# Altium project Soldeerstation.PrjPcb
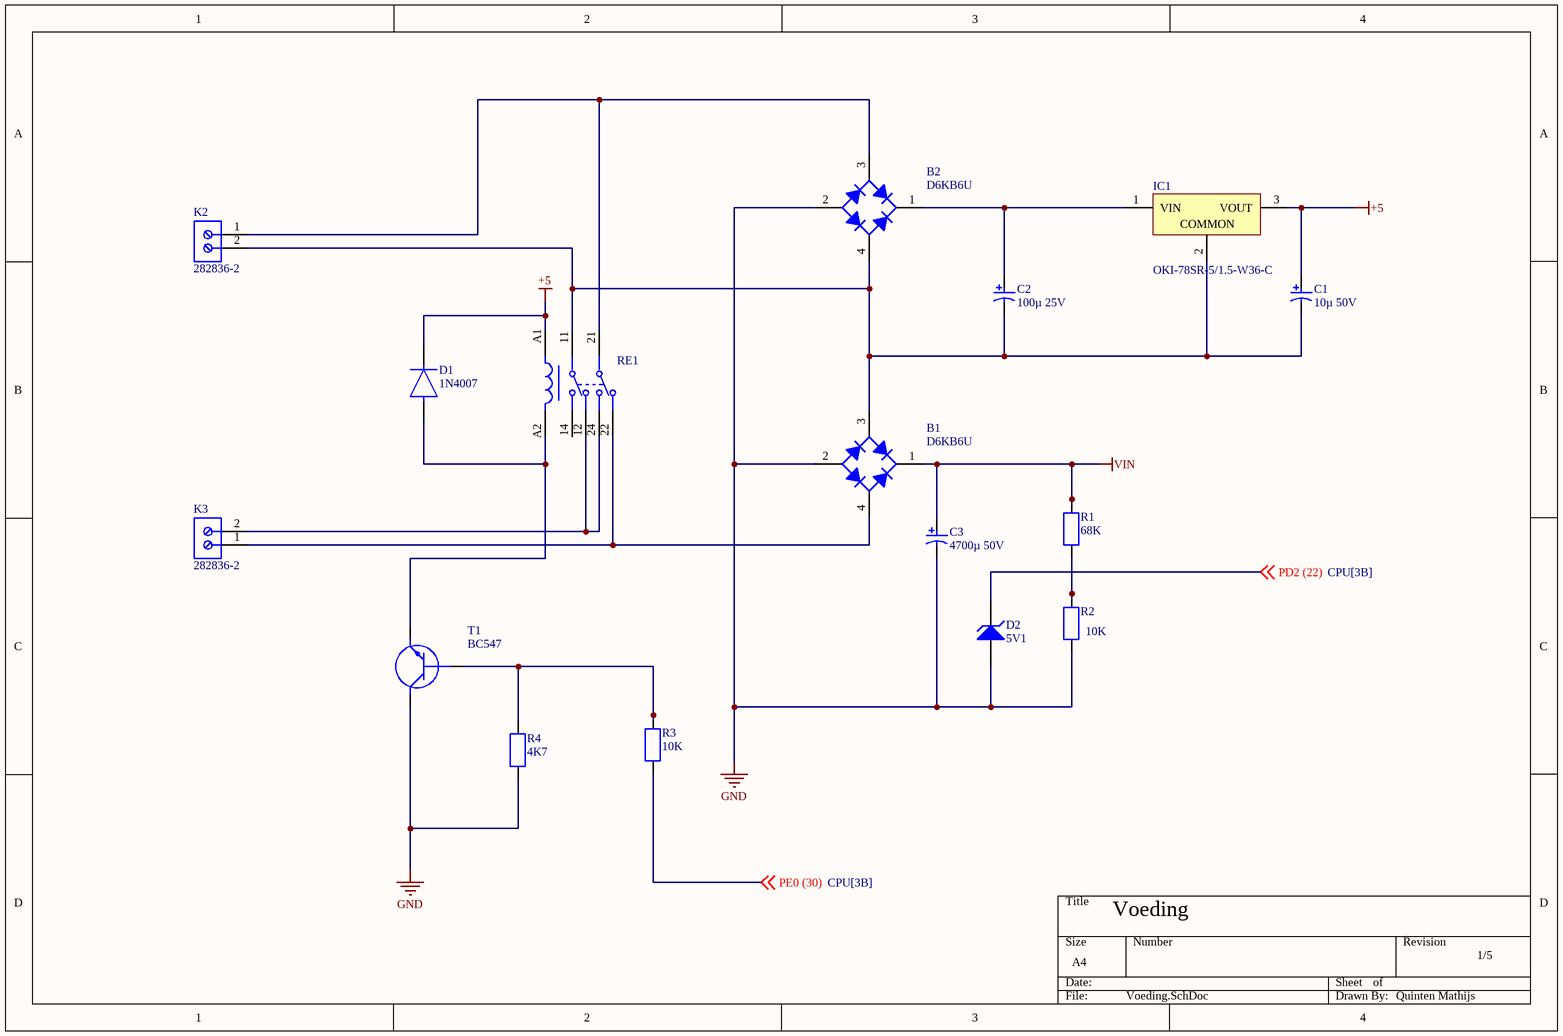
[diagram p0: Voeding.SchDoc]
5 sheets, 74 parts. Net scope: global (net labels, ports and power ports of the same name join across sheets).
Board file: PCB1.PcbDoc
Sheets:
  Voeding.SchDoc
  CPU.SchDoc
  Display.SchDoc
  PWM_soldeerbout.SchDoc
  Thermokoppel.SchDoc

## Sheet Voeding.SchDoc: Soldeerstation
size A4; Revision: 1/5; SheetNumber: 1; SheetTotal: 5

### Parts
B1  D6KB6U  [ttf]
B2  D6KB6U  [ttf]
C1  10µ 50V  [CE_D8_L10]
C2  100µ 25V  [CE_D8_L10]
C3  4700µ 50V  [CE_D25_L25_plugin]
D1  1N4007  [SOD-123FL]
D2  5V1  [SOD-123FL]
IC1  OKI-78SR-5/1.5-W36-C  [OKI78SR515W36C]
K2  282836-2  [TECO-282836-2_V]
K3  282836-2  [TECO-282836-2_V]
R1  68K  [R_0805_L]
R2  10K  [R_0805_L]
R3  10K  [R_0805_L]
R4  4K7  [R_0805_L]
RE1  (no value)  [RT42]
T1  BC547  [SOT_23]

### Nets
+5: C1.2 D1.1(C) IC1.3(VOUT) RE1.A1
GND: B1.2(A) B2.2(A) C3.1 D2.2(A) R2.1 R4.1 T1.1(C)
VIN: B1.1(K) C3.2 R1.2
PD2 (22): D2.1(K) ; off-sheet PD2 (22)
PE0 (30): R3.1 ; off-sheet PE0 (30)
NetB1_3: B1.3(C) B2.4(C) C1.1 C2.1 IC1.2(COMMON) K2.2 RE1.11
NetB1_4: B1.4(C) K3.1 RE1.22
NetB2_1: B2.1(K) C2.2 IC1.1(VIN)
NetB2_3: B2.3(C) K2.1 RE1.21
NetD1_2: D1.2(A) RE1.A2 T1.3(E)
NetK3_2: K3.2 RE1.12 RE1.24
NetR1_1: R1.1 R2.2
NetR3_2: R3.2 R4.2 T1.2(B)

Not connected (* = marked no-connect by the designer): RE1 14

### Notes on the sheet
- Voeding
- 1/5
- Quinten Mathijs

### Library data of the parts
B1 B2 = Bridge_Rectifier: Manufacturer: Diodes Inc; Average Rectified Current-Max: 0.8A; Reverse Voltage-Max [Vrrm]: 600V; Forward Voltage: 1V; Peak Current-Max: 30A; Reverse Current-Max: 5µA; Package Version: 05/2016; Package URL: http://www.diodes.com/_files/packages/MiniDIP.pdf; Datasheet Version: Rev. 13-2, 12/2010; Datasheet URL: http://www.diodes.com/_files/datasheets/ds17003.pdf; Mounting Technology: SurfaceMount; Manufacturer URL: http://www.diodes.com/; Package Reference: MiniDIP-4; Package Description: 4-Pin Small Outline Integrated Circuit, Body 4.7 x 3.8 mm, Pitch 2.5 mm
C1 C3 = Capacitor_Electrolytic: Manufacturer: Panasonic; Voltage Rating: 25 V; ComponentLink2URL: http://industrial.panasonic.com/cdbs/www-data/pdf/RDE0000/ABA0000C1181.pdf; Height: 10.2 mm; Max Operating Temperature: 105 degC; PackageReference: EEE-FK1E221P; ComponentLink1Description: Manufacturer URL; ComponentLink1URL: http://www.panasonic.com/; Mount: Surface Mount; REACH SVHC: No SVHC; Min Operating Temperature: -55 degC; ComponentLink2Description: Datasheet; DatasheetVersion: 03/2016; Length: 10.2 mm; RoHSCompliant: true; Packaging: Tape and Reel; Package Quantity: 500; Lead Pitch: 3.1 mm; Pins: 2; PackageDescription: 2-Pin Electrolytic Aluminum Capacitor, Body 8.3 x 8.3 mm; Mounting Technology: Surface Mount
C2 = Capacitor_Electrolytic: Manufacturer: Panasonic; ComponentLink2URL: http://industrial.panasonic.com/cdbs/www-data/pdf/RDE0000/ABA0000C1181.pdf; Voltage Rating: 25 V; Height: 10.2 mm; Max Operating Temperature: 105 degC; PackageReference: EEE-FK1E221P; ComponentLink1Description: Manufacturer URL; ComponentLink1URL: http://www.panasonic.com/; Mount: Surface Mount; REACH SVHC: No SVHC; Min Operating Temperature: -55 degC; ComponentLink2Description: Datasheet; DatasheetVersion: 03/2016; Length: 10.2 mm; RoHSCompliant: true; Packaging: Tape and Reel; Package Quantity: 500; Lead Pitch: 3.1 mm; Pins: 2; PackageDescription: 2-Pin Electrolytic Aluminum Capacitor, Body 8.3 x 8.3 mm; Mounting Technology: Surface Mount
D1 = Diode: Manufacturer: Diotec; Max Surge Forward Current: 27A; Forward Current: 1A; Max Junction Temp: +175°C; Reverse Voltage: 1000V; Value: 15pF; Peak Reverse Current: 5uA; Category: Diode; Temperature Range Low: -50°C; Automotive: No; Temperature: -50°C to +175°C; Lead Free: Yes; ComponentLink2Description: Datasheet; Max Repetitive Reverse Voltage: 1000V; ComponentLink2URL: https://datasheet.octopart.com/1N4007-Diotec-datasheet-62346875.pdf; Manufacturer Part Number: 1N4007; Device Class L3: Rectifier Diodes; Height: 2.8mm; Octopart: https://octopart.com/1n4007-diotec-4040411; Package: 1N4007; Temperature Range High: +175°C; Device Class L1: Discrete Semiconductors; Device Class L2: Diodes; RoHS: TRUE; Capacitance: 15pF; Ipc Land Pattern Name: DIOAD888W100L520D280
D2 = Zener_Diode: Manufacturer: On Semiconductor; PartNumber: 1SMB5920BT3G; Packing: Tape and Reel; VZ Typ (V): 6.2; PackageDescription: 2-Pin Small Molded Package, J-Bend Lead, Body 4.33 x 3.625 mm; Mounting Technology: Surface Mount; PackageVersion: Rev. H, 05/2011; ComponentLink1Description: Manufacturer URL; RoHS: Pb-Free; DatasheetVersion: Rev. 8; ComponentLink2Description: Datasheet; ComponentLink2URL: http://www.onsemi.com/pub_link/Collateral/1SMB5913BT3-D.PDF; ComponentLink1URL: http://www.onsemi.com/; ComponentLink3Description: Package Specification; PackageReference: SMB-2-403A-03_H; ComponentLink3URL: http://www.onsemi.com/pub_link/Collateral/1SMB5913BT3-D.PDF
IC1 = OKI-78SR-5/1.5-W36-C: Non-Isolated DC/DC Converter, 7.5 W, 7 to 36 V, 1.5 A, -40 to 85 degC, 3-Pin THD, RoHS; Manufacturer: Murata; Current - Output (Max): 1.5A; Power (Watts) - Max: 8W; Efficiency: 90.5%; Voltage - Input (Min): 7V; Voltage - Input (Max): 36V; Voltage - Output 1: 5V; Number of Outputs: 1; Package / Case: 3-SIPModule; Features: SCP; Type: LinearRegulatorReplacement; Size / Dimension: 0.41"Lx0.30"Wx0.65"H(10.4mmx7.6mmx16.5mm); Datasheet URL: https://datasheet.ciiva.com/8006/1790439-8006672.pdf; Datasheet Version: Oct-13; Power (Watts) - Manufacture Series: 8W; Voltage - Output 2: -; Series: Okami™OKI-78SR; Family: DCDCConverters; Manufacturer URL: http://www.murata.com/; Category: PowerSupplies-BoardMount; Voltage - Isolation: -; Packaging: Tube; Applications: ITE(Commercial); Mounting Type: ThroughHole; Voltage - Output 3: -; Operating Temperature: -40degC~85degC
K2 K3 = CMP-1684-00017-1: Female Header, Pitch 5 mm, 1 x 2 Position, Height 10 mm, Tail Length 3.5 mm, Rohs, Bulk; Manufacturer: TE Connectivity; Wire Gauge: 16-30AWG; Product Training Modules: Wire-to-BoardEurostyleTerminalBlocks; Clamp Material - Plating: Brass-NickelPlated; Voltage: 300V; Mating Orientation: HorizontalwithBoard; Current: 13.5A; Pitch: 0.197"(5.00mm); Screw Thread: M3; 3D Model: 282836-2.pdf; Other Names: 5ULV-02B / A98076; Dynamic Catalog: BuchananSeries; Number of Levels: 1; Torque - Screw: 0.68Nm(6Lb-In); Featured Product: EurostyleTerminalBlockConnectors; Positions Per Level: 2; Wire Termination: Screw-RisingCageClamp; Datasheet URL: http://www.te.com.cn/commerce/DocumentDelivery/DDEController?Action=showdoc&DocId=Catalog+Section%7F1308389_EUROSTYLE_TERMINAL_BLOCKS%7F0607%7Fpdf%7FEnglish%7FENG_CS_1308389_EUROSTYLE_TERMINAL_BLOCKS_0607.pdf%7F282836-2; Color: Green; Family: TerminalBlocks-WiretoBoard; RoHS Information: 282836-2StatementofCompliance; Standard Package: 300; Contact Material - Plating: Brass-TinPlated; Manufacturer URL: http://www.te.com; Housing Material: Polyamide(PA66),Nylon6/6; Features: Interlocking(Side); Package Description: Female Header, Pitch 5 mm, 1 x 2 Position, Height 10 mm, Tail Length 3.5 mm; Mounting Type: ThroughHole; Package Reference: THD; Packaging: Bulk; Series: Buchanan; Category: Connectors,Interconnects; Screw Material - Plating: Brass-NickelPlated
R1-R4 = 0805 (Resistor): Resistor; Manufacturer: Vishay Dale; Part Number: CRCW08050000Z0EA
RE1 = RELAY_GENERAL_PURPOSE: Manufacturer Part Number: RT424005; Manufacturer: TE Connectivity; Coil Power: 403mW; Throw Configuration: DPDT; Coil Voltage: 5V; Number Of Contacts: 2; Coil Resistance: 62Ω; Current Rating: 8A; Coil Type: Non-Latching; Category: Relay; Octopart: https://octopart.com/5-1393243-9-te+connectivity-41835766; Device Class L3: Power Relays; ComponentLink2URL: https://www.te.com/commerce/DocumentDelivery/DDEController?Action=showdoc&DocId=Data+Sheet%7FRT2%7F1014%7Fpdf%7FEnglish%7FENG_DS_RT2_1014.pdf%7F5-1393243-9; Ambient Temperature Range High: +85°C; ComponentLink2Description: Datasheet; Digikey Description: RELAY GENERAL PURPOSE DPDT 8A 5V; Package: RT424005; Automotive: No; Device Class L1: Electromechanical; Height: 15.7mm; Device Class L2: Relays; Ambient Temperature Range Low: -40°C; Mouser Description: General Purpose Relay, Rt2 Series, Power, Non Latching, Dpdt, 5 Vdc, 8 A Rohs Compliant: Yes; Lead Free: Yes; RoHS: TRUE
T1 = Transistor_NPN: Manufacturer: On Semiconductor; PartNumber: BC547C; IC Continuous (A): 0.1; fT Min (MHz): 150; Packing: Bulk Box; Polarity: NPN; Mounting Technology: Through Hole; ComponentLink1URL: http://www.onsemi.com/; ComponentLink1Description: Manufacturer URL; ComponentLink3URL: http://www.onsemi.cn/pub_link/Collateral/2N6426-D.PDF; DatasheetVersion: Rev. 7; PackageVersion: Rev. AM; RoHS: FALSE; ComponentLink2URL: http://www.onsemi.com/pub_link/Collateral/BC546-D.PDF; ComponentLink3Description: Package Specification; PackageDescription: 3-Pin Transistor Outline, Body 4.825 x 3.685 mm, Pitch 1.27 mm; PackageReference: TO-92-3-29-11_AM_SL; ComponentLink2Description: Datasheet

## Sheet CPU.SchDoc
size A4; SheetNumber: 2; SheetTotal: 5
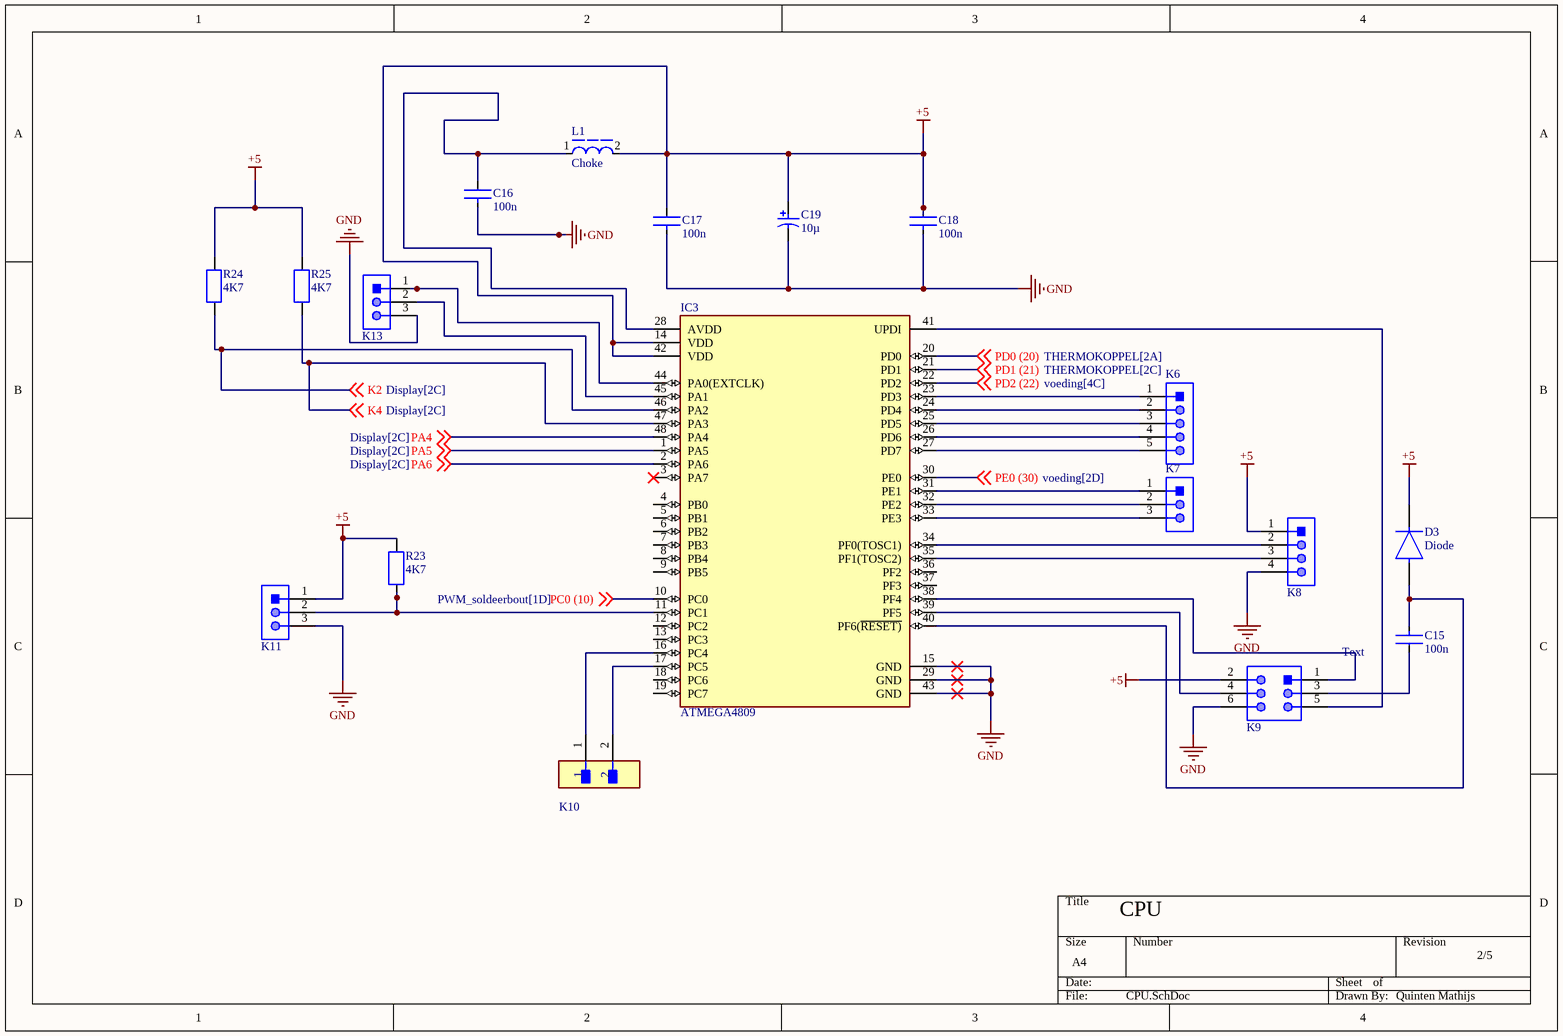
[diagram p1: CPU.SchDoc]

### Parts
C15  100n  [CC_0805_L]
C16  100n  [CC_0805_L]
C17  100n  [CC_0805_L]
C18  100n  [CC_0805_L]
C19  10µ  [CE_D8_L10]
D3  Diode  [SOD-123FL]
IC3  ATMEGA4809  [TQFP_48_M]
K6  (no value)  [pin header 1x5]
K7  (no value)  [pin header 1x3]
K8  61300411121  [pin header 1x4]  (value not drawn)
K9  61300621121  [pin header 2x6]  (value not drawn)
K10  M20-9990246  [pin header 1x2]  (value not drawn)
K11  61300311121  [pin header 1x3]  (value not drawn)
K13  61300311121  [pin header 1x3]  (value not drawn)
L1  Choke  [CC_0805_L]
R23  4K7  [R_0805_L]
R24  4K7  [R_0805_L]
R25  4K7  [R_0805_L]

### Nets
+5: C17.2 C18.2 C19.2 D3.1(C) IC3.14(VDD) IC3.42(VDD) K8.1 K9.2 K11.1 L1.2 R23.2 R24.2 R25.2
GND: C16.1 C17.1 C18.1 C19.1 IC3.15(GND) IC3.29(GND) IC3.43(GND) K8.4 K9.6 K11.3 K13.3
K2: IC3.46(PA2) R24.1 ; off-sheet K2
K4: IC3.47(PA3) R25.1 ; off-sheet K4
PA4: IC3.48(PA4) ; off-sheet PA4
PA5: IC3.1(PA5) ; off-sheet PA5
PA6: IC3.2(PA6) ; off-sheet PA6
PC0 (10): IC3.10(PC0) ; off-sheet PC0 (10)
PD0 (20): IC3.20(PD0) ; off-sheet PD0 (20)
PD1 (21): IC3.21(PD1) ; off-sheet PD1 (21)
PD2 (22): IC3.22(PD2) ; off-sheet PD2 (22)
PE0 (30): IC3.30(PE0) ; off-sheet PE0 (30)
NetC15_1: C15.1 D3.2(A) IC3.40(PF6(~{RESET)})
NetC15_2: C15.2 K9.3
NetC16_2: C16.2 IC3.28(AVDD) L1.1
NetIC3_11: IC3.11(PC1) K11.2 R23.1
NetIC3_16: IC3.16(PC4) K10.1
NetIC3_17: IC3.17(PC5) K10.2
NetIC3_23: IC3.23(PD3) K6.1
NetIC3_24: IC3.24(PD4) K6.2
NetIC3_25: IC3.25(PD5) K6.3
NetIC3_26: IC3.26(PD6) K6.4
NetIC3_27: IC3.27(PD7) K6.5
NetIC3_31: IC3.31(PE1) K7.1
NetIC3_32: IC3.32(PE2) K7.2
NetIC3_33: IC3.33(PE3) K7.3
NetIC3_34: IC3.34(PF0(TOSC1)) K8.2
NetIC3_35: IC3.35(PF1(TOSC2)) K8.3
NetIC3_38: IC3.38(PF4) K9.1
NetIC3_39: IC3.39(PF5) K9.4
NetIC3_41: IC3.41(UPDI) K9.5
NetIC3_44: IC3.44(PA0(EXTCLK)) K13.1
NetIC3_45: IC3.45(PA1) K13.2

Not connected (* = marked no-connect by the designer): IC3 3(PA7)* 4(PB0) 5(PB1) 6(PB2) 7(PB3) 8(PB4) 9(PB5) 12(PC2) 13(PC3) 18(PC6) 19(PC7) 36(PF2) 37(PF3)

### Notes on the sheet
- Text
- CPU
- 2/5
- Quinten Mathijs

### Library data of the parts
C15-C18 = Capacitor_Ceramic: Manufacturer: KEMET; Manufacturer Part Number: C0805C224K5RACTU; Value: 0.22 μF; Temperature Characteristic: X7R; Temperature Coefficient: 30ppm/°C; Tolerance: 0.1; Voltage Rating: 50 V; ComponentLink2URL: https://content.kemet.com/datasheets/KEM_C1003_C0G_SMD.pdf; Device Class L3: Ceramic Capacitors; Lead Free: Yes; Temperature: -55°C to +125°C; RoHS: TRUE; Capacitance: 0.22 μF; Automotive: No; Material: Ceramic; Octopart: https://octopart.com/c0805c224k5ractu-kemet-144670; Temperature Range Low: -55°C; Height: 0.88mm; Device Class L1: Passive Components; Digikey Description: CAP CER 0.22UF 50V X7R 0805; ComponentLink2Description: Datasheet; Mouser Description: CAP CER 0.22UF 50V X7R 0805; Category: Cap; Ipc Land Pattern Name: CAPC200125X78; Temperature Range High: +125°C; Package: C0805C-DN; Device Class L2: Capacitors
C19 = Capacitor_Electrolytic: as C1 on sheet Voeding; ComponentLink2URL: http://industrial.panasonic.com/cdbs/www-data/pdf/RDE0000/ABA0000C1181.pdf; Height: 10.2 mm; Max Operating Temperature: 105 degC; PackageReference: EEE-FK1E221P; ComponentLink1Description: Manufacturer URL; ComponentLink1URL: http://www.panasonic.com/; Mount: Surface Mount; REACH SVHC: No SVHC; Min Operating Temperature: -55 degC; ComponentLink2Description: Datasheet; DatasheetVersion: 03/2016; Length: 10.2 mm; RoHSCompliant: true; Packaging: Tape and Reel; Package Quantity: 500; Lead Pitch: 3.1 mm; Pins: 2; PackageDescription: 2-Pin Electrolytic Aluminum Capacitor, Body 8.3 x 8.3 mm; Mounting Technology: Surface Mount
D3 = Diode: Manufacturer Part Number: 1N4007; Manufacturer: Diotec; Max Surge Forward Current: 27A; Forward Current: 1A; Max Junction Temp: +175°C; Reverse Voltage: 1000V; Value: 15pF; Peak Reverse Current: 5uA; Category: Diode; Temperature Range Low: -50°C; Automotive: No; Temperature: -50°C to +175°C; Lead Free: Yes; ComponentLink2Description: Datasheet; Max Repetitive Reverse Voltage: 1000V; ComponentLink2URL: https://datasheet.octopart.com/1N4007-Diotec-datasheet-62346875.pdf; Device Class L3: Rectifier Diodes; Height: 2.8mm; Octopart: https://octopart.com/1n4007-diotec-4040411; Package: 1N4007; Temperature Range High: +175°C; Device Class L1: Discrete Semiconductors; Device Class L2: Diodes; RoHS: TRUE; Capacitance: 15pF; Ipc Land Pattern Name: DIOAD888W100L520D280
IC3 = ATMEGA4809: Peripherals: Brown-out Detect/Reset; Number of I/Os: 41; Core Architecture: AVR; Memory Size: 48KB; Interface: I2C; Oscillator Type: Internal; Memory Type: FLASH; Series: megaAVR® 0, Functional Safety (FuSa); Min Operating Temperature: -40°C; Mount: Surface Mount; Case/Package: TQFP; RoHS Compliant: Yes; Max Operating Temperature: 85°C
K6 = pin header 1x5: THT Vertical Pin Header WR-PHD, Pitch 2.54 mm, Single Row, 5 pins; Part Number: 61300511121; Manufacturer: Wurth Elektronik; Pin Number: 5; Contact Resistance: 20mOhm; Working Voltage: 250VAC; Pitch: 2.54mm; Withstanding Voltage: 500VAC; Rated Current: 3A; Gender: Male; Datasheet URL: https://katalog.we-online.de/em/datasheet/6130xx11121.pdf; Orientation: Vertical; Mounting Technology: THT; Row Number: Single; Package Reference: 61300511121; Publisher: WurthElektronik; Packaging: Bag; Manufacturer URL: http://www.we-online.de; Operating Temperature: -40to105degC
K7 = pin header 1x3pin: THT Vertical Pin Header WR-PHD, Pitch 2.54 mm, Single Row, 3 pins; Part Number: 61300311121; Manufacturer: Wurth Elektronik; Withstanding Voltage: 500VAC; Working Voltage: 250VAC; Rated Current: 3A; Pitch: 2.54mm; Pin Number: 3; Gender: Male; Contact Resistance: 20mOhm; Package Reference: 61300311121; Manufacturer URL: http://www.we-online.de; Datasheet URL: https://katalog.we-online.de/em/datasheet/6130xx11121.pdf; Operating Temperature: -40to105degC; Orientation: Vertical; Packaging: Bag; Row Number: Single; Mounting Technology: THT; Publisher: WurthElektronik
K8 = pin header 1x4: THT Vertical Pin Header WR-PHD, Pitch 2.54 mm, Single Row, 4 pins; Manufacturer: Wurth Elektronik; Withstanding Voltage: 500VAC; Rated Current: 3A; Working Voltage: 250VAC; Pin Number: 4; Gender: Male; Contact Resistance: 20mOhm; Pitch: 2.54mm; Manufacturer URL: http://www.we-online.de; Operating Temperature: -40to105degC; Packaging: Bag; Mounting Technology: THT; Package Reference: 61300411121; Datasheet URL: https://katalog.we-online.de/em/datasheet/6130xx11121.pdf; Publisher: WurthElektronik; Part Number: 61300411121; Row Number: Single; Orientation: Vertical
K9 = pin header 2x6: THT Vertical Pin Header WR-PHD, Pitch 2.54 mm, Dual Row, 6 pins; Manufacturer: Wurth Elektronik; Contact Resistance: 20mOhm; Withstanding Voltage: 500VAC; Pin Number: 6; Gender: Male; Pitch: 2.54mm; Working Voltage: 250VAC; Rated Current: 3A; Packaging: Bag; Row Number: Dual; Manufacturer URL: http://www.we-online.de; Part Number: 61300621121; Operating Temperature: -40to105degC; Mounting Technology: THT; Package Reference: 61300621121; Datasheet URL: https://katalog.we-online.de/em/datasheet/6130xx21121.pdf; Orientation: Vertical; Publisher: WurthElektronik
K10 = pin header 1x2: CONN HEADER VERT 2POS 2.54MM; Manufacturer: Harwin; Conn Gender: Male; Conn Orientation: Vertical; Number Of Contacts: 2; Current Rating: 3A; ComponentLink2URL: https://cdn.harwin.com/pdfs/M20-999.pdf; ComponentLink2Description: Datasheet; Package: M20-9990246; Temperature: -40°C to +105°C; Octopart: https://octopart.com/m20-9990246-harwin-2590635; Mouser Description: 2.54mm (0.1") Pitch SIL Vertical PC Tail Pin Header, 6.1mm mating pin height, tin, 2 contacts; Temperature Range High: +105°C; Device Class L1: Connectors; RoHS: TRUE; Automotive: No; Height: 8.99mm; Number Of Rows: 1; Contact Material: Tin,Nickel; Category: Conn; Pitch: 2.54mm; Lead Free: Yes; Digikey Description: CONN HEADER VERT 2POS 2.54MM; Manufacturer Part Number: M20-9990246; Temperature Range Low: -40°C; Device Class L3: unset; Device Class L2: Headers and Wire Housings
K11 K13 = pin header 1x3pin: THT Vertical Pin Header WR-PHD, Pitch 2.54 mm, Single Row, 3 pins; Manufacturer: Wurth Elektronik; Withstanding Voltage: 500VAC; Working Voltage: 250VAC; Rated Current: 3A; Pitch: 2.54mm; Pin Number: 3; Gender: Male; Contact Resistance: 20mOhm; Package Reference: 61300311121; Manufacturer URL: http://www.we-online.de; Datasheet URL: https://katalog.we-online.de/em/datasheet/6130xx11121.pdf; Operating Temperature: -40to105degC; Part Number: 61300311121; Orientation: Vertical; Packaging: Bag; Row Number: Single; Mounting Technology: THT; Publisher: WurthElektronik
L1 = Choke: smoorspoel; Tolerance: 20%; Shielding: Shielded; Saturation Current: 10A; Test Frequency: 100kHz; RMS Current (Irms): 8.5A; Inductance: 10uH; Series Resistance: 14.1R; DC Resistance (DCR): 14.1mR; Self Resonant Frequency: 18MHz; Ratings: AEC-Q200; Width: 12.8mm; Series: WE-HCI; Length: 0.512inch; Mount: Surface Mount; Resistor Type: Wirewound; RoHS Compliant: Yes; Package Quantity: 1; Min Operating Temperature: -40°C; Inductance Tolerance: 20%; Termination: SMD/SMT; Max DC Current: 8.5A; Height - Seated (Max): 0.197inch; Case/Package: 1350; Current Rating: 8.5A; Max Operating Temperature: 155°C; Packaging: Tape and Reel; Height: 4.7mm
R23-R25 = 0805 (Resistor): as R1 on sheet Voeding

## Sheet Display.SchDoc
size A4; SheetNumber: 3; SheetTotal: 5
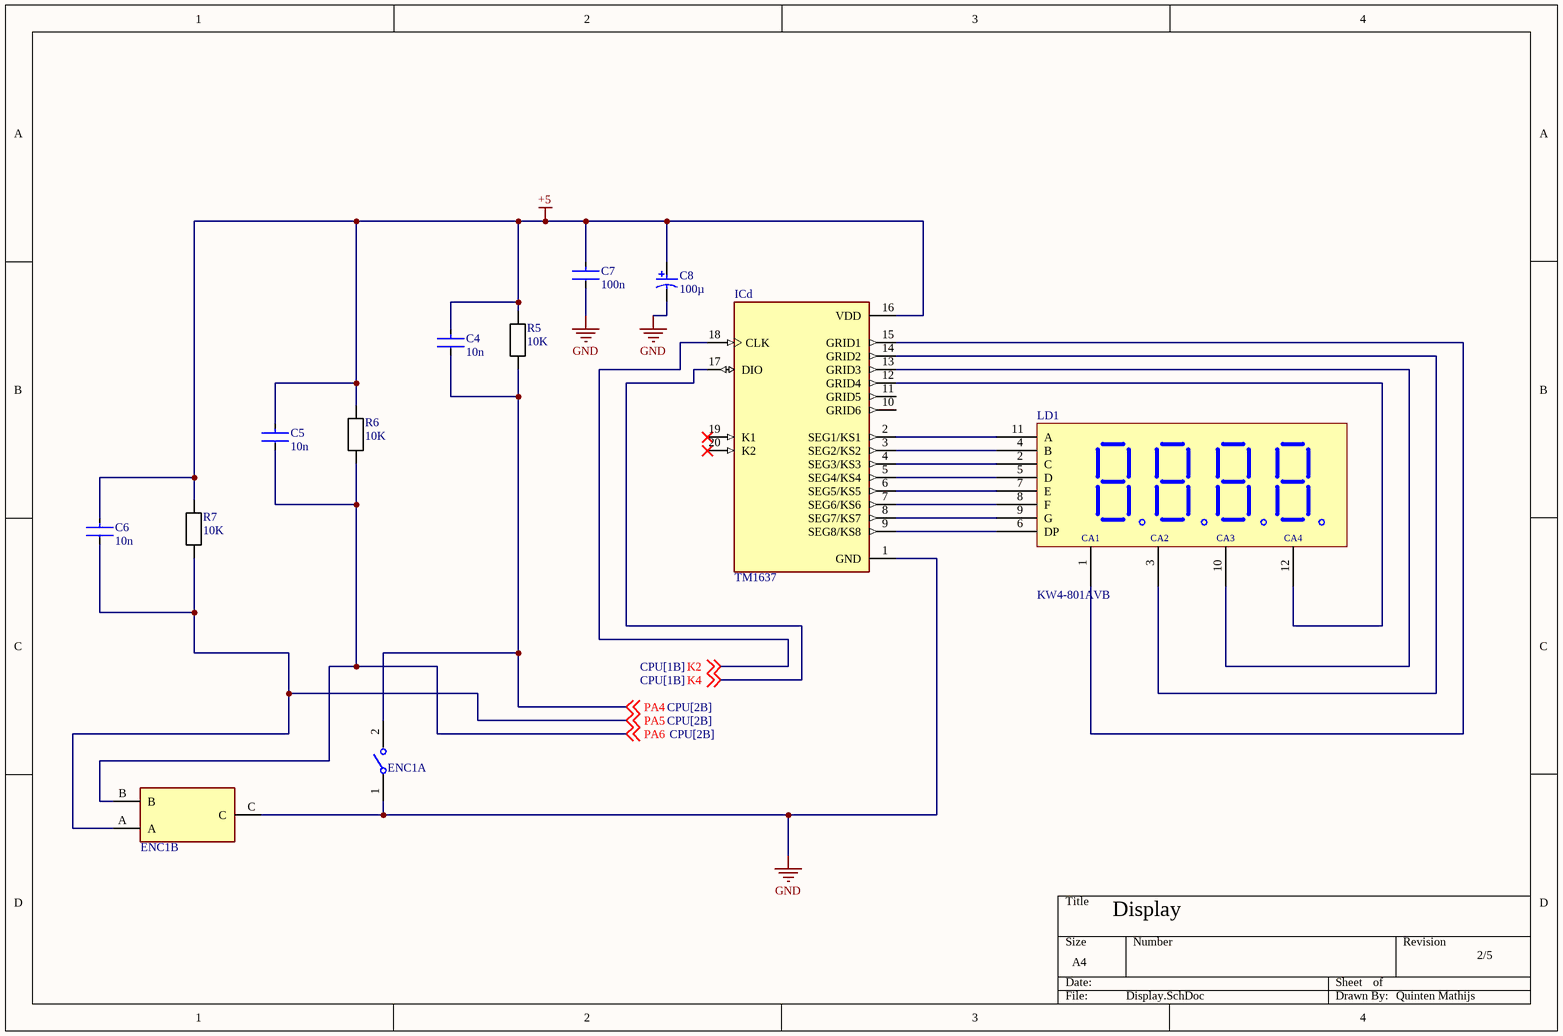
[diagram p2: Display.SchDoc]

### Parts
C4  10n  [CC_0805_L]
C5  10n  [CC_0805_L]
C6  10n  [CC_0805_L]
C7  100n  [CC_0805_L]
C8  100µ  [CE_D8_L10]
ENC1  PEC11R-4220F-S0012  [PEC11R_4220F_S0012]  (value not drawn)  (parts A,B of 2)
ICd  TM1637  [SOP_20_M]
LD1  KW4-801AVB  [7-Segment]
R5  10K  [R_0805_L]
R6  10K  [R_0805_L]
R7  10K  [R_0805_L]

### Nets
+5: C4.1 C5.1 C6.1 C7.1 C8.2 ICd.16(VDD) R5.2 R6.2 R7.1
GND: C7.2 C8.1 ENC1.1 ENC1.C ICd.1(GND)
K2: ICd.18(CLK) ; off-sheet K2
K4: ICd.17(DIO) ; off-sheet K4
PA4: C4.2 ENC1.2 R5.1 ; off-sheet PA4
PA5: C6.2 ENC1.A R7.2 ; off-sheet PA5
PA6: C5.2 ENC1.B R6.1 ; off-sheet PA6
NetICd_2: ICd.2(SEG1/KS1) LD1.11(A)
NetICd_3: ICd.3(SEG2/KS2) LD1.4(B)
NetICd_4: ICd.4(SEG3/KS3) LD1.2(C)
NetICd_5: ICd.5(SEG4/KS4) LD1.5(D)
NetICd_6: ICd.6(SEG5/KS5) LD1.7(E)
NetICd_7: ICd.7(SEG6/KS6) LD1.8(F)
NetICd_8: ICd.8(SEG7/KS7) LD1.9(G)
NetICd_9: ICd.9(SEG8/KS8) LD1.6(DP)
NetICd_12: ICd.12(GRID4) LD1.12
NetICd_13: ICd.13(GRID3) LD1.10
NetICd_14: ICd.14(GRID2) LD1.3
NetICd_15: ICd.15(GRID1) LD1.1(CA1)

Not connected (* = marked no-connect by the designer): ICd 10(GRID6) 11(GRID5) 19(K1)* 20(K2)*

### Notes on the sheet
- Display
- 2/5
- Quinten Mathijs
- (in symbol KW4-801AVB) CA2; CA3; CA4

### Library data of the parts
C4-C7 = Capacitor_Ceramic: as C15 on sheet CPU; ComponentLink2URL: https://content.kemet.com/datasheets/KEM_C1003_C0G_SMD.pdf; Device Class L3: Ceramic Capacitors; Lead Free: Yes; Temperature: -55°C to +125°C; RoHS: TRUE; Capacitance: 0.22 μF; Automotive: No; Material: Ceramic; Octopart: https://octopart.com/c0805c224k5ractu-kemet-144670; Temperature Range Low: -55°C; Height: 0.88mm; Device Class L1: Passive Components; Digikey Description: CAP CER 0.22UF 50V X7R 0805; ComponentLink2Description: Datasheet; Mouser Description: CAP CER 0.22UF 50V X7R 0805; Category: Cap; Ipc Land Pattern Name: CAPC200125X78; Temperature Range High: +125°C; Package: C0805C-DN; Device Class L2: Capacitors
C8 = Capacitor_Electrolytic: as C1 on sheet Voeding; ComponentLink2URL: http://industrial.panasonic.com/cdbs/www-data/pdf/RDE0000/ABA0000C1181.pdf; Height: 10.2 mm; Max Operating Temperature: 105 degC; PackageReference: EEE-FK1E221P; ComponentLink1Description: Manufacturer URL; ComponentLink1URL: http://www.panasonic.com/; Mount: Surface Mount; REACH SVHC: No SVHC; Min Operating Temperature: -55 degC; ComponentLink2Description: Datasheet; DatasheetVersion: 03/2016; Length: 10.2 mm; RoHSCompliant: true; Packaging: Tape and Reel; Package Quantity: 500; Lead Pitch: 3.1 mm; Pins: 2; PackageDescription: 2-Pin Electrolytic Aluminum Capacitor, Body 8.3 x 8.3 mm; Mounting Technology: Surface Mount
ENC1 = PEC11R-4220F-S0012: ROTARY ENCODER MECHANICAL 12PPR; Built in Switch: Yes; Number of Channels: 2; Output Type: Quadrature; Hole Diameter: 7mm; Pulses per Revolution: 12; Termination: PC Pin; Package Quantity: 150; RoHS Compliant: Yes; Mount: Through Hole; Width: 12.5mm; Radiation Hardening: No; Number of Pins: 5; REACH SVHC: No SVHC; Type: Mechanical; Packaging: Bulk; Min Operating Temperature: -30°C; Encoder Type: Mechanical; Height: 13.4mm; Length: 26.5mm; Orientation: Vertical; Max Operating Temperature: 70°C; Series: PEC11R; Detent: Yes
ICd = TM1637: LED Drive Control Special Circuit; MF: Titan Micro Electronics; Package: Package; Availability: Not in stock; SnapEDA_Link: https://www.snapeda.com/parts/TM1637/Titan+Micro+Electronics/view-part/?ref=snap; MP: TM1637; Check_prices: https://www.snapeda.com/parts/TM1637/Titan+Micro+Electronics/view-part/?ref=eda; Value: *; Price: None
LD1 = KW4-801AVB: 4-Digit LED Display
R5-R7 = 0805 (Resistor): as R1 on sheet Voeding

## Sheet PWM_soldeerbout.SchDoc
size A4; SheetNumber: 4; SheetTotal: 5
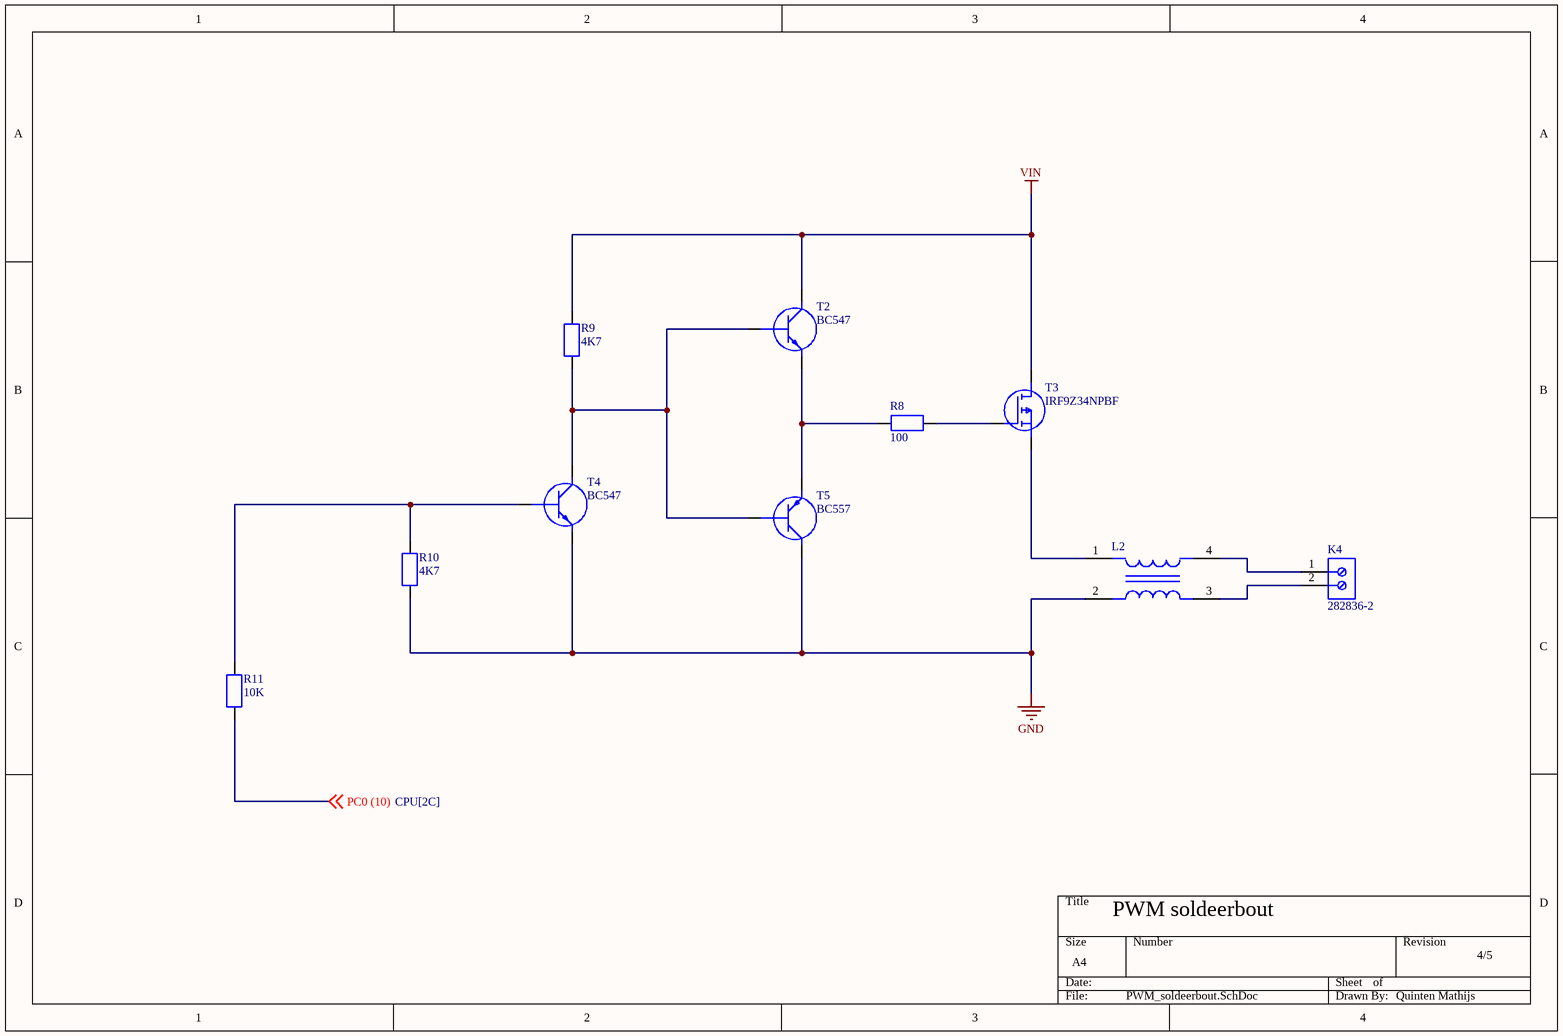
[diagram p3: PWM_soldeerbout.SchDoc]

### Parts
K4  282836-2  [TECO-282836-2_V]
L2  (no value)  [2545]
R8  100  [R_0805_L]
R9  4K7  [R_0805_L]
R10  4K7  [R_0805_L]
R11  10K  [R_0805_L]
T2  BC547  [SOT_23]
T3  IRF9Z34NPBF  [TO_252]
T4  BC547  [SOT_23]
T5  BC557  [SOT_23]

### Nets
GND: L2.2 R10.1 T4.3(E) T5.3(C)
VIN: R9.2 T2.1(C) T3.3(D)
PC0 (10): R11.1 ; off-sheet PC0 (10)
NetK4_1: K4.1 L2.4
NetK4_2: K4.2 L2.3
NetL2_1: L2.1 T3.2(S)
NetR8_1: R8.1 T2.3(E) T5.1(E)
NetR8_2: R8.2 T3.1(G)
NetR9_1: R9.1 T2.2(B) T4.1(C) T5.2(B)
NetR10_2: R10.2 R11.2 T4.2(B)

### Notes on the sheet
- PWM soldeerbout
- 4/5
- Quinten Mathijs

### Library data of the parts
K4 = CMP-1684-00017-1: as K2 on sheet Voeding; Datasheet URL: http://www.te.com.cn/commerce/DocumentDelivery/DDEController?Action=showdoc&DocId=Catalog+Section%7F1308389_EUROSTYLE_TERMINAL_BLOCKS%7F0607%7Fpdf%7FEnglish%7FENG_CS_1308389_EUROSTYLE_TERMINAL_BLOCKS_0607.pdf%7F282836-2; Color: Green; Family: TerminalBlocks-WiretoBoard; RoHS Information: 282836-2StatementofCompliance; Standard Package: 300; Contact Material - Plating: Brass-TinPlated; Manufacturer URL: http://www.te.com; Housing Material: Polyamide(PA66),Nylon6/6; Features: Interlocking(Side); Package Description: Female Header, Pitch 5 mm, 1 x 2 Position, Height 10 mm, Tail Length 3.5 mm; Mounting Type: ThroughHole; Package Reference: THD; Packaging: Bulk; Series: Buchanan; Category: Connectors,Interconnects; Screw Material - Plating: Brass-NickelPlated
L2 = Common_Mode_Choke: Max Current Rating: 2A; Number of Lines: 2; Impedance: 900R; Element Configuration: Dual; Insulation Resistance: 10MR; Test Frequency: 100MHz; DC Resistance (DCR): 60mR; Voltage Rating (DC): 50V; Current Rating: 2.3A; Number of Pins: 4; DC Current: 2A; Mount: Surface Mount; Current: 2A; REACH SVHC: No SVHC; Width: 4.5mm; Case/Package: 1808; Voltage Rating: 50V; Package Quantity: 1; Height: 2mm; Max DC Current: 2A; Packaging: Tape and Reel; Max Operating Temperature: 85°C; Lead Free: Lead Free; Length: 0.185inch; Series: ACM; Radiation Hardening: No; Max Voltage Rating (DC): 50V; Termination: Flat; Depth: 4.7mm; RoHS Compliant: Yes; DC Resistance-Max: 60mR; Min Operating Temperature: -40°C
R8-R11 = 0805 (Resistor): as R1 on sheet Voeding
T2 T4 = Transistor_NPN: as T1 on sheet Voeding; Mounting Technology: Through Hole; ComponentLink1URL: http://www.onsemi.com/; ComponentLink1Description: Manufacturer URL; ComponentLink3URL: http://www.onsemi.cn/pub_link/Collateral/2N6426-D.PDF; DatasheetVersion: Rev. 7; PackageVersion: Rev. AM; RoHS: FALSE; ComponentLink2URL: http://www.onsemi.com/pub_link/Collateral/BC546-D.PDF; ComponentLink3Description: Package Specification; PackageDescription: 3-Pin Transistor Outline, Body 4.825 x 3.685 mm, Pitch 1.27 mm; PackageReference: TO-92-3-29-11_AM_SL; ComponentLink2Description: Datasheet
T3 = MOSFET_P: Manufacturer: Fairchild Semiconductor; Reel Quantity: 3000; Drain Source Voltage Vds: 20V; Power Dissipation Pd: 500mW; On Resistance Rds(on): 52mohm; Full Power Rating Temperature: 25°C; Voltage Vgs Max: -800mV; Pulse Current Idm: 10A; Rds(on) Test Voltage Vgs: -4.5V; External Depth: 2.5mm; Transistor Case Style: SOT-23; No. of Pins: 3; Continuous Drain Current Id: 2.4A; Voltage Vds Typ: -20V; Voltage Vgs th Max: -1.5V; Transistor Polarity: PChannel; Package Version: Rev. 3, 05/2015; External Width: 3.05mm; External Length / Height: 1.12mm; SMD Marking: 304P; SVHC: NoSVHC(19-Dec-2012); Termination Type: SMD; Datasheet URL: https://www.fairchildsemi.com/datasheets/FD/FDN304P.pdf; Tape Width: 8mm; Mounting Technology: SurfaceMount; Voltage Vgs Rds on Measurement: -4.5V; Operating Temperature Range: -55°Cto+150°C; Current Temperature: 25°C; Operating Temperature Min: -55°C; Threshold Voltage Vgs Typ: -800mV; Package / Case: SOT-23; Manufacturer URL: https://www.fairchildsemi.com/; Voltage Vds: 20V; Datasheet Version: Rev. C, 01/2001; Operating Temperature Max: 150°C; Package Description: 3-Pin Small Outline Transistor, Body 2.92 x 1.4 mm, Pitch 0.95 mm; Current Id Max: 2.4A; Package URL: https://www.fairchildsemi.com/package-drawings/MA/MA03B.pdf; Package Reference: SSOT3L
T5 = Transistor_PNP: Manufacturer: On Semiconductor; PartNumber: BC557C; Polarity: PNP; IC Continuous (A): -0.1; Packing: Bulk Box; PackageVersion: Rev. AM; RoHS: FALSE; PackageDescription: 3-Pin Transistor Outline, Body 4.825 x 3.685 mm, Pitch 1.27 mm; ComponentLink2Description: Datasheet; DatasheetVersion: Rev. 3; ComponentLink3Description: Package Specification; Mounting Technology: Through Hole; ComponentLink2URL: http://www.onsemi.com/pub_link/Collateral/BC556B-D.PDF; ComponentLink1URL: http://www.onsemi.com/; ComponentLink1Description: Manufacturer URL; ComponentLink3URL: http://www.onsemi.cn/pub_link/Collateral/2N6426-D.PDF; PackageReference: TO-92-3-29-11_AM_SL

## Sheet Thermokoppel.SchDoc: Soldeerstation
size A4; DrawnBy: Quinten Mathijs; SheetNumber: 5; SheetTotal: 5; Number: 2023_02_001; Sheet of: 5/5
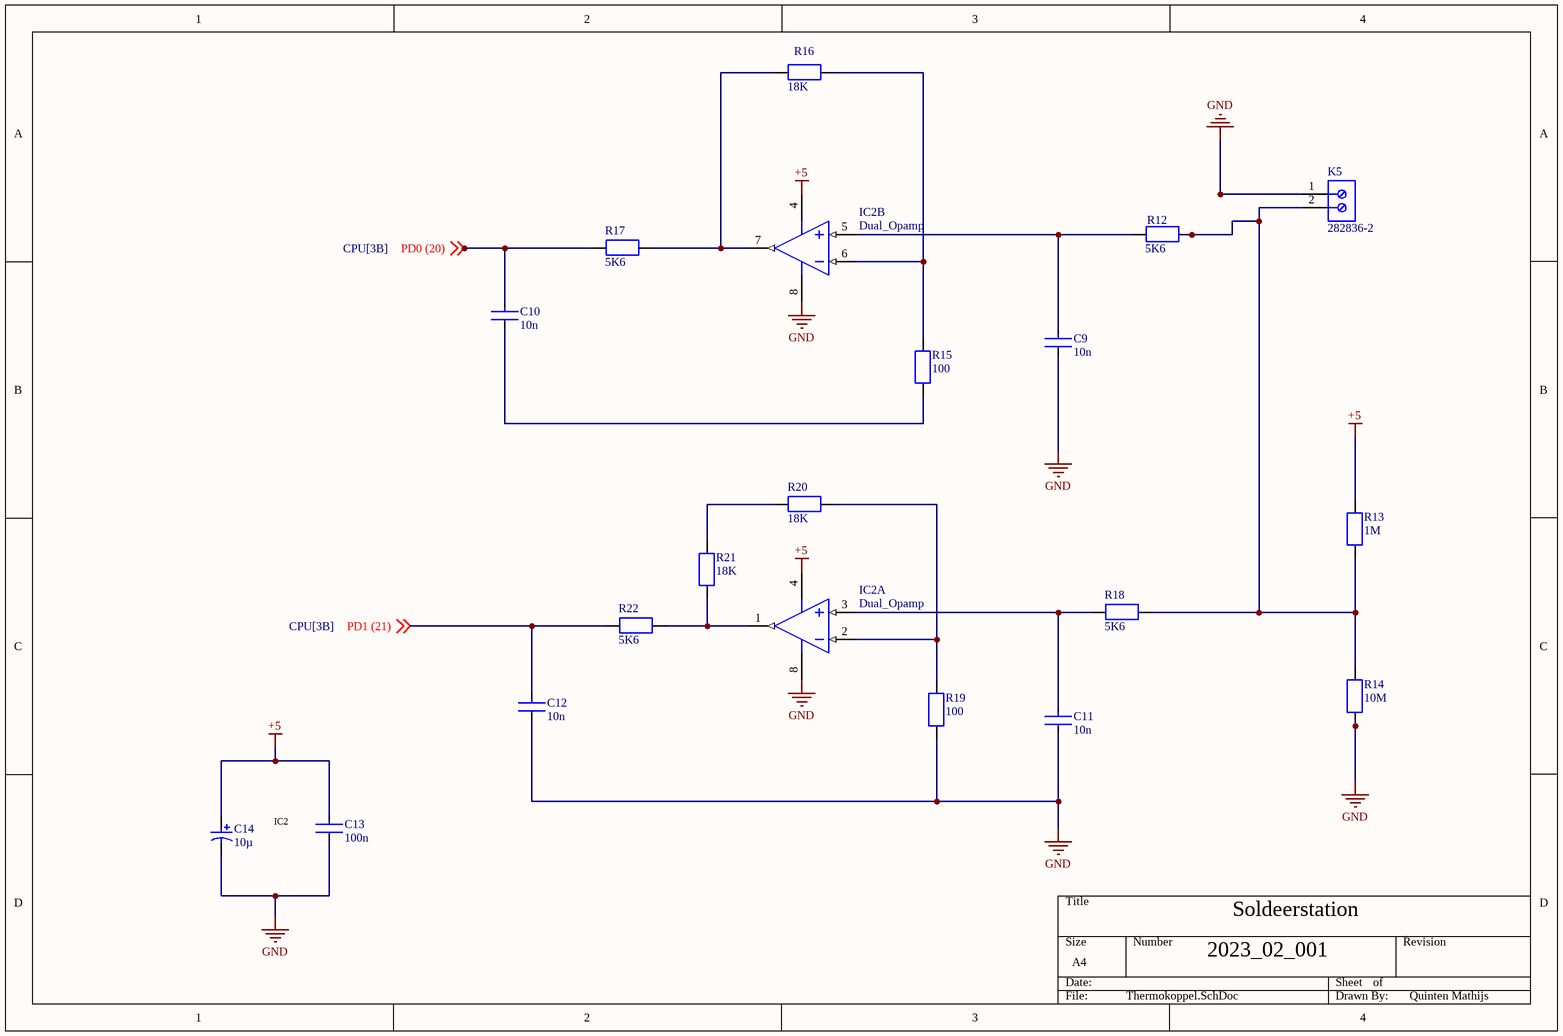
[diagram p4: Thermokoppel.SchDoc]

### Parts
C9  10n  [CC_0805_L]
C10  10n  [CC_0805_L]
C11  10n  [CC_0805_L]
C12  10n  [CC_0805_L]
C13  100n  [CC_0805_L]
C14  10µ  [CE_D8_L10]
IC2  Dual_Opamp  [MSOP_8_M]  (parts A,B of 2)
K5  282836-2  [TECO-282836-2_V]
R12  5K6  [R_0805_L]
R13  1M  [R_0805_L]
R14  10M  [R_0805_L]
R15  100  [R_0805_L]
R16  18K  [R_0805_L]
R17  5K6  [R_0805_L]
R18  5K6  [R_0805_L]
R19  100  [R_0805_L]
R20  18K  [R_0805_L]
R21  18K  [R_0805_L]
R22  5K6  [R_0805_L]

### Nets
+5: C13.1 C14.2 IC2.4(VSS) R13.2
GND: C9.2 C11.2 C12.2 C13.2 C14.1 IC2.8(VDD) K5.1 R14.1 R19.1
PD0 (20): C10.1 R17.1 ; off-sheet PD0 (20)
PD1 (21): C12.1 R22.1 ; off-sheet PD1 (21)
NetC9_1: C9.1 IC2.5(VINB+) R12.1
NetC10_2: C10.2 R15.1
NetC11_1: C11.1 IC2.3(VINA+) R18.1
NetIC2_1: IC2.1(VOUTA) R21.1 R22.2
NetIC2_2: IC2.2(VINA-) R19.2 R20.2
NetIC2_6: IC2.6(VINB-) R15.2 R16.2
NetIC2_7: IC2.7(VOUTB) R16.1 R17.2
NetK5_2: K5.2 R12.2 R13.1 R14.2 R18.2
NetR20_1: R20.1 R21.2

### Notes on the sheet
- IC2

### Library data of the parts
C9-C13 = Capacitor_Ceramic: as C15 on sheet CPU; ComponentLink2URL: https://content.kemet.com/datasheets/KEM_C1003_C0G_SMD.pdf; Device Class L3: Ceramic Capacitors; Lead Free: Yes; Temperature: -55°C to +125°C; RoHS: TRUE; Capacitance: 0.22 μF; Automotive: No; Material: Ceramic; Octopart: https://octopart.com/c0805c224k5ractu-kemet-144670; Temperature Range Low: -55°C; Height: 0.88mm; Device Class L1: Passive Components; Digikey Description: CAP CER 0.22UF 50V X7R 0805; ComponentLink2Description: Datasheet; Mouser Description: CAP CER 0.22UF 50V X7R 0805; Category: Cap; Ipc Land Pattern Name: CAPC200125X78; Temperature Range High: +125°C; Package: C0805C-DN; Device Class L2: Capacitors
C14 = Capacitor_Electrolytic: as C1 on sheet Voeding; ComponentLink2URL: http://industrial.panasonic.com/cdbs/www-data/pdf/RDE0000/ABA0000C1181.pdf; Height: 10.2 mm; Max Operating Temperature: 105 degC; PackageReference: EEE-FK1E221P; ComponentLink1Description: Manufacturer URL; ComponentLink1URL: http://www.panasonic.com/; Mount: Surface Mount; REACH SVHC: No SVHC; Min Operating Temperature: -55 degC; ComponentLink2Description: Datasheet; DatasheetVersion: 03/2016; Length: 10.2 mm; RoHSCompliant: true; Packaging: Tape and Reel; Package Quantity: 500; Lead Pitch: 3.1 mm; Pins: 2; PackageDescription: 2-Pin Electrolytic Aluminum Capacitor, Body 8.3 x 8.3 mm; Mounting Technology: Surface Mount
IC2 = Dual_Opamp: Slew Rate: 0.6V/µs; Supply Current: 100uA; Power Supply Rejection Ratio (PSRR): 86dB; Input Offset Voltage (Vos): 4.5mV; Input Bias Current: 1pA; Amplifier Type: GENERAL PURPOSE; Unity Gain Bandwidth Product: 1MHz; Number of Circuits: 2; Output Current: 23mA; Operating Supply Voltage: 5.5V; Min Supply Voltage: 1.8V; Common Mode Rejection Ratio: 60dB; Voltage Gain: 112dB; Max Supply Voltage: 6V; Package Quantity: 60; REACH SVHC: No SVHC; Min Operating Temperature: -40°C; Max Operating Temperature: 125°C; Mount: Through Hole; Nominal Supply Current: 100uA; Height: 3.3mm; Length: 9.27mm; Slew Rate-Nom: 0.6V/µs; Packaging: Rail/Tube; Output Current per Channel: 23mA; Number of Amplifiers: 2; RoHS Compliant: Yes; Radiation Hardening: No; Bandwidth: 1MHz; Lead Free: Lead Free; Width: 6.35mm; Number of Channels: 2; Gain Bandwidth Product: 1MHz; Technology: CMOS; Operating Supply Current: 100uA; Number of Elements: 2; Number of Pins: 8; Input Offset Voltage-Max: 4.5mV; Case/Package: PDIP
K5 = CMP-1684-00017-1: as K2 on sheet Voeding; Datasheet URL: http://www.te.com.cn/commerce/DocumentDelivery/DDEController?Action=showdoc&DocId=Catalog+Section%7F1308389_EUROSTYLE_TERMINAL_BLOCKS%7F0607%7Fpdf%7FEnglish%7FENG_CS_1308389_EUROSTYLE_TERMINAL_BLOCKS_0607.pdf%7F282836-2; Color: Green; Family: TerminalBlocks-WiretoBoard; RoHS Information: 282836-2StatementofCompliance; Standard Package: 300; Contact Material - Plating: Brass-TinPlated; Manufacturer URL: http://www.te.com; Housing Material: Polyamide(PA66),Nylon6/6; Features: Interlocking(Side); Package Description: Female Header, Pitch 5 mm, 1 x 2 Position, Height 10 mm, Tail Length 3.5 mm; Mounting Type: ThroughHole; Package Reference: THD; Packaging: Bulk; Series: Buchanan; Category: Connectors,Interconnects; Screw Material - Plating: Brass-NickelPlated
R12-R22 = 0805 (Resistor): as R1 on sheet Voeding

## Nets that join several sheets
+5: Voeding (C1.2 D1.1 IC1.3 RE1.A1), CPU (13 pins), Display (9 pins), Thermokoppel (C13.1 C14.2 IC2.4 R13.2)
GND: Voeding (7 pins), CPU (11 pins), Display (5 pins), PWM_soldeerbout (L2.2 R10.1 T4.3 T5.3), Thermokoppel (9 pins)
VIN: Voeding (B1.1 C3.2 R1.2), PWM_soldeerbout (R9.2 T2.1 T3.3)
K2: CPU (IC3.46 R24.1), Display (ICd.18)
K4: CPU (IC3.47 R25.1), Display (ICd.17)
PA4: CPU (IC3.48), Display (C4.2 ENC1.2 R5.1)
PA5: CPU (IC3.1), Display (C6.2 ENC1.A R7.2)
PA6: CPU (IC3.2), Display (C5.2 ENC1.B R6.1)
PC0 (10): CPU (IC3.10), PWM_soldeerbout (R11.1)
PD0 (20): CPU (IC3.20), Thermokoppel (C10.1 R17.1)
PD1 (21): CPU (IC3.21), Thermokoppel (C12.1 R22.1)
PD2 (22): Voeding (D2.1), CPU (IC3.22)
PE0 (30): Voeding (R3.1), CPU (IC3.30)